# Altium schematic sheet MainBoard_interface.SchDoc: Main Board interface
size A4; Author: Luis; Organization: UNICAMP / LCEE; Address1: University of Campinas - Brazil; Address2: Power Conditioning Laboratory; Address3: Licensed by GNU GPL 3.0; ProjectName: Easy Inverter
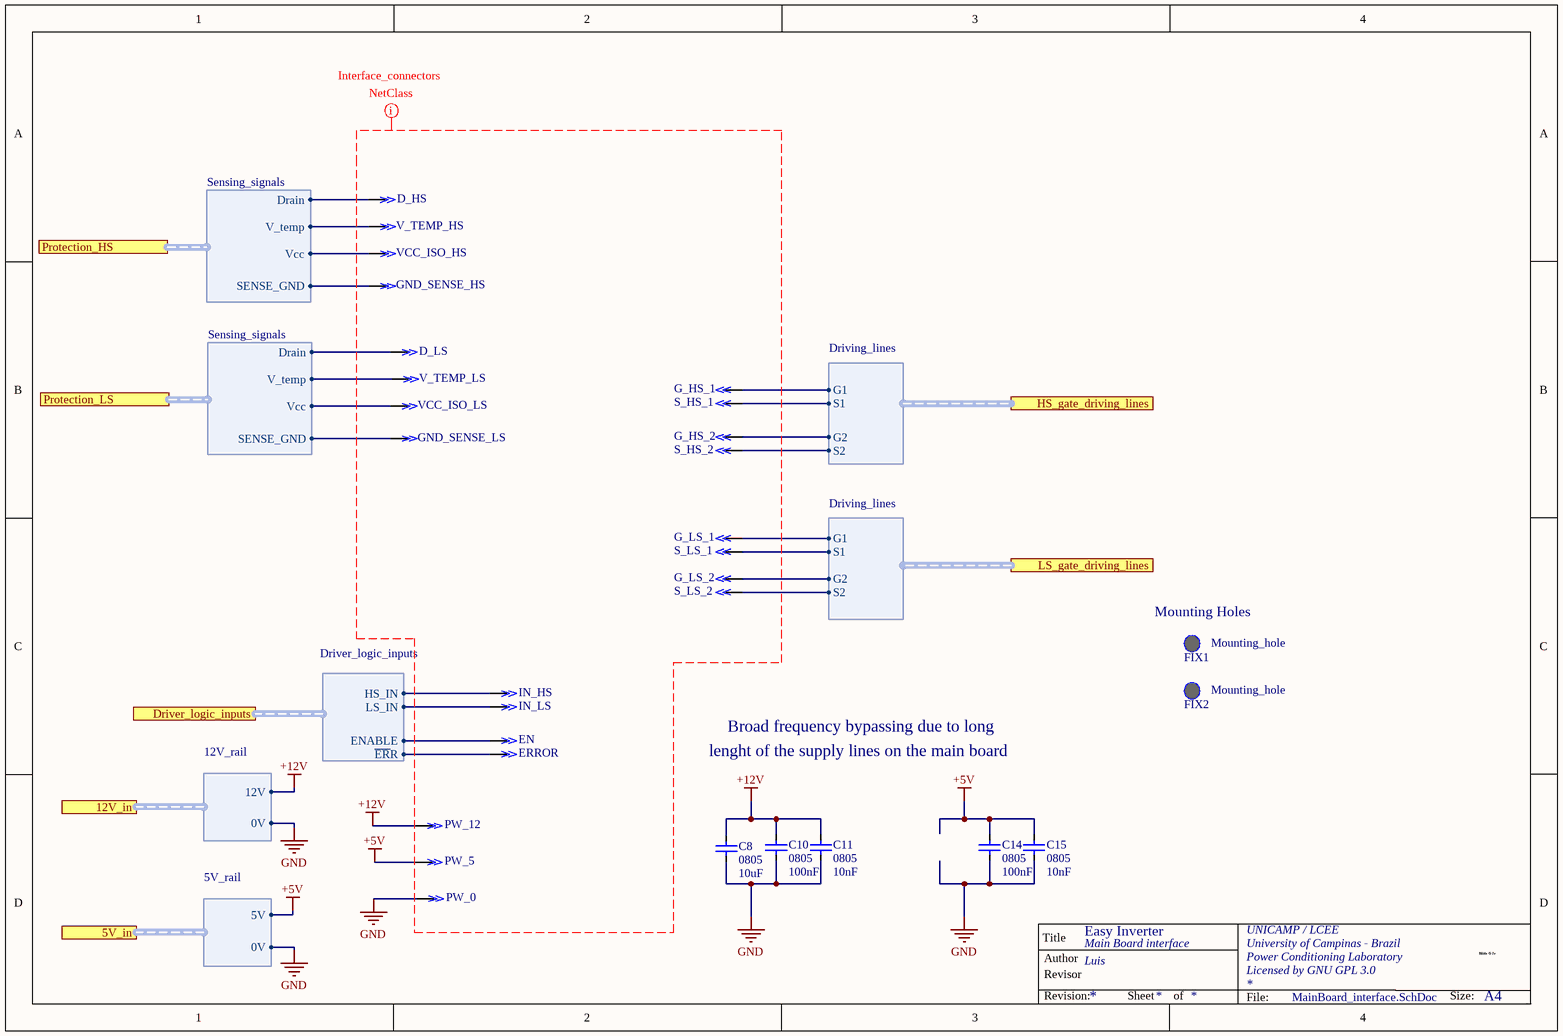
[diagram p0: MainBoard_interface.SchDoc]

## Parts
C8  0805  value 10uF  [Capacitor 0805]
C10  0805  value 100nF  [Capacitor 0805]
C11  0805  value 10nF  [Capacitor 0805]
C14  0805  value 100nF  [Capacitor 0805]
C15  0805  value 10nF  [Capacitor 0805]
D_HS  Board interconection  [Single pad - Right Angle]  (value not drawn)
D_LS  Board interconection  [Single pad - Right Angle]  (value not drawn)
EN  Board interconection  [Single pad - Right Angle]  (value not drawn)
ERROR  Board interconection  [Single pad - Right Angle]  (value not drawn)
FIX1  Mounting_hole  [Mounting Hole - GateDriver-Right Angle]  (no BOM)
FIX2  Mounting_hole  [Mounting Hole - GateDriver-Right Angle]  (no BOM)
G_HS_1  Board interconection  [Single pad - Right Angle]  (value not drawn)
G_HS_2  Board interconection  [Single pad - Right Angle]  (value not drawn)
G_LS_1  Board interconection  [Single pad - Right Angle]  (value not drawn)
G_LS_2  Board interconection  [Single pad - Right Angle]  (value not drawn)
GND_SENSE_HS  Board interconection  [Single pad - Right Angle]  (value not drawn)
GND_SENSE_LS  Board interconection  [Single pad - Right Angle]  (value not drawn)
IN_HS  Board interconection  [Single pad - Right Angle]  (value not drawn)
IN_LS  Board interconection  [Single pad - Right Angle]  (value not drawn)
PW_0  Board interconection  [Single pad - Right Angle]  (value not drawn)
PW_5  Board interconection  [Single pad - Right Angle]  (value not drawn)
PW_12  Board interconection  [Single pad - Right Angle]  (value not drawn)
S_HS_1  Board interconection  [Single pad - Right Angle]  (value not drawn)
S_HS_2  Board interconection  [Single pad - Right Angle]  (value not drawn)
S_LS_1  Board interconection  [Single pad - Right Angle]  (value not drawn)
S_LS_2  Board interconection  [Single pad - Right Angle]  (value not drawn)
V_TEMP_HS  Board interconection  [Single pad - Right Angle]  (value not drawn)
V_TEMP_LS  Board interconection  [Single pad - Right Angle]  (value not drawn)
VCC_ISO_HS  Board interconection  [Single pad - Right Angle]  (value not drawn)
VCC_ISO_LS  Board interconection  [Single pad - Right Angle]  (value not drawn)

## Ports
5V_in (harness 5V_rail), 12V_in (harness 12V_rail), Driver_logic_inputs (harness Driver_logic_inputs), HS_gate_driving_lines (harness Driving_lines), LS_gate_driving_lines (harness Driving_lines), Protection_HS (harness Sensing_signals), Protection_LS (harness Sensing_signals)

## Harnesses
Driving_lines: G1, G2, S1, S2
12V_rail: 0V, 12V
Driver_logic_inputs: ~{ER}R, ENABLE, HS_IN, LS_IN
5V_rail: 0V, 5V
Sensing_signals: V_temp, Vcc, Drain, SENSE_GND

## Nets
+5V: C14.1 C15.1 PW_5.1 ; port 5V_in.5V
+12V: C8.1 C10.1 C11.1 PW_12.1 ; port 12V_in.12V
GND: C8.2 C10.2 C11.2 C14.2 C15.2 PW_0.1 ; port 12V_in.0V, port 5V_in.0V
NetD_HS_1: D_HS.1 ; port Protection_HS.Drain
NetD_LS_1: D_LS.1 ; port Protection_LS.Drain
NetEN_1: EN.1 ; port Driver_logic_inputs.ENABLE
NetERROR_1: ERROR.1 ; port Driver_logic_inputs.~{ER}R
NetG_HS_1_1: G_HS_1.1 ; port HS_gate_driving_lines.G1
NetG_HS_2_1: G_HS_2.1 ; port HS_gate_driving_lines.G2
NetG_LS_1_1: G_LS_1.1 ; port LS_gate_driving_lines.G1
NetG_LS_2_1: G_LS_2.1 ; port LS_gate_driving_lines.G2
NetGND_SENSE_HS_1: GND_SENSE_HS.1 ; port Protection_HS.SENSE_GND
NetGND_SENSE_LS_1: GND_SENSE_LS.1 ; port Protection_LS.SENSE_GND
NetIN_HS_1: IN_HS.1 ; port Driver_logic_inputs.HS_IN
NetIN_LS_1: IN_LS.1 ; port Driver_logic_inputs.LS_IN
NetS_HS_1_1: S_HS_1.1 ; port HS_gate_driving_lines.S1
NetS_HS_2_1: S_HS_2.1 ; port HS_gate_driving_lines.S2
NetS_LS_1_1: S_LS_1.1 ; port LS_gate_driving_lines.S1
NetS_LS_2_1: S_LS_2.1 ; port LS_gate_driving_lines.S2
NetV_TEMP_HS_1: V_TEMP_HS.1 ; port Protection_HS.V_temp
NetV_TEMP_LS_1: V_TEMP_LS.1 ; port Protection_LS.V_temp
NetVCC_ISO_HS_1: VCC_ISO_HS.1 ; port Protection_HS.Vcc
NetVCC_ISO_LS_1: VCC_ISO_LS.1 ; port Protection_LS.Vcc

## Layout directives
net class Interface_connectors: +5V, +12V, GND

## Notes on the sheet
- (near FIX1) Mounting Holes
- Broad frequency bypassing due to long
- lenght of the supply lines on the main board
- Title
- Author
- Revisor
- Hildo G Jr
- Revision:
- Sheet
- of
- File:
- Size:
- A4
- HGJr

## Library data of the parts
C8 C10 C11 C14 C15 = Capacitor 0805: SMD ceramic capacitor 0805; pn: undefined; ClassName: Direct_plane_connect
D_HS D_LS EN ERROR G_HS_1 G_HS_2 G_LS_1 G_LS_2 GND_SENSE_HS GND_SENSE_LS IN_HS IN_LS PW_0 PW_5 PW_12 S_HS_1 S_HS_2 S_LS_1 S_LS_2 V_TEMP_HS V_TEMP_LS VCC_ISO_HS VCC_ISO_LS = Board interconection: Interconection between gatedriver and main board; Value: Male Header 1 pin - 90 degrees; System: Connector; pn: *
  S_HS_1 S_HS_2 S_LS_1 S_LS_2: ClassName: Direct_plane_connect
FIX1 FIX2 = Mounting_hole: Mount Hole, to interface MainBoard with GatedriverBoard or MainBoard with heatsink; value: none; pn: none